# EAGLE design adapt (EAGLE 5.02)
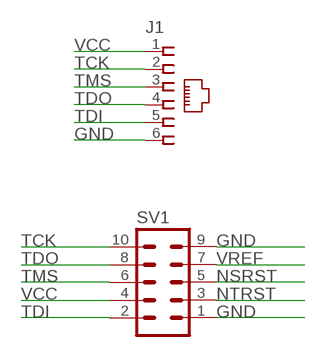
[diagram p0: schematic, sheet 1]

## Parts
J1  520250-3  [520250-3]
SV1  ML10L  [ML10L]

## Nets
GND: J1.6 SV1.1 SV1.9
NSRST: SV1.5
NTRST: SV1.3
TCK: J1.2 SV1.10
TDI: J1.5 SV1.2
TDO: J1.4 SV1.8
TMS: J1.3 SV1.6
VCC: J1.1 SV1.4
VREF: SV1.7

## Library data of the parts
J1 = con-amp:520250-3: AMP connector
SV1 = con-harting-ml:ML10: HARTING

## Board
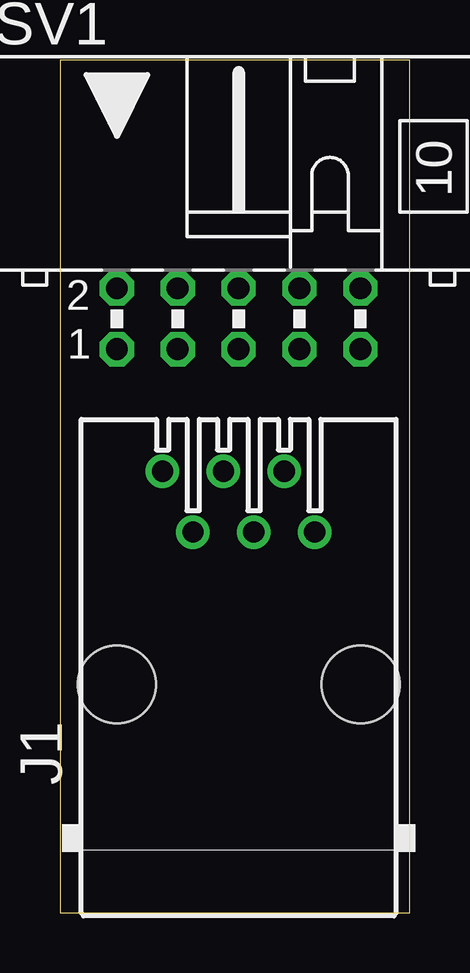
[diagram p1: board, top side]
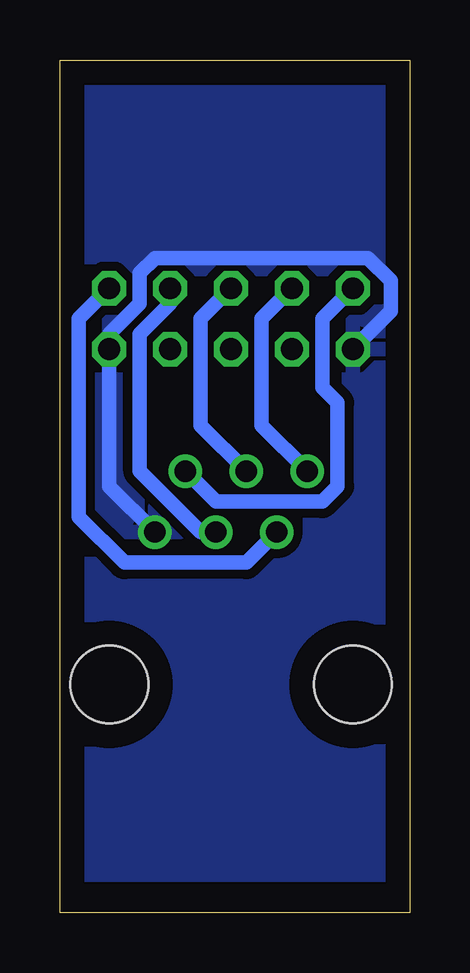
[diagram p2: board, bottom side, seen from below]

Size 14.59 x 35.55 mm. Coordinates in mm from the lower left corner, seen from the top.
Outline: 0,0 14.59,0 14.59,35.55 0,35.55 0,0
Copper layers (1*16): Top 0.035mm / dielectric 1.5mm / Bottom 0.035mm
Design rules "default *": minimum track width 10mil, minimum drill 24mil, track to track 15mil, track to pad 15mil, pad to pad 15mil, via to via 15mil, smd to smd 8mil, copper to edge 40mil, drill to drill 8mil, minimum pad ring 10mil, minimum via ring 8mil, stop-mask expansion 4mil, vias tented up to drill 0mil, thermal gap 10mil

### Footprints (pad centres in the part's own frame; a part is rotated, then mirrored left to right if it is on the bottom)
520250-3 = drill 0.889 round: 1 -3.175,8.89; 2 -1.905,6.35; 3 -0.635,8.89; 4 0.635,6.35; 5 1.905,8.89; 6 3.175,6.35 | hole 3.251: -5.08,0; 5.08,0
ML10L = drill 0.914 octagon: 1 -5.08,-1.27; 2 -5.08,1.27; 3 -2.54,-1.27; 4 -2.54,1.27; 5 0,-1.27; 6 0,1.27; 7 2.54,-1.27; 8 2.54,1.27; 9 5.08,-1.27; 10 5.08,1.27

### Placement (x,y rotation side)
J1  7.46,9.52 0 top
SV1  7.46,24.76 0 top

### Tracks (layer width: path | path; a pad name or v marks a point on that pad's centre or on a via)
GND
  Bottom 0.61: SV1.1 0.79,25.08 0.79,26.35 1.74,27.3 10.63,27.3 11.27,26.66 11.27,25.39 12.54,24.12 SV1.9 12.54,17.77 J1.6
  pour Bottom: 0.47,36.19 15.08,36.19 15.08,1.58 0.47,1.58
TCK
  Bottom 0.61: SV1.10 13.8,24.76 13.8,16.5 11.9,14.6 6.82,14.6 J1.2
TDI
  Bottom 0.61: SV1.2 3.65,24.76 3.65,21.9 3.01,21.27 3.01,17.77 3.65,17.14 8.09,17.14 J1.5
TDO
  Bottom 0.61: SV1.8 10,25.39 11.27,24.12 11.27,18.41 8.72,15.87 J1.4
TMS
  Bottom 0.61: SV1.6 8.72,24.76 8.72,20.31 J1.3
VCC
  Bottom 0.61: SV1.4 6.19,24.76 6.19,20.31 J1.1

### Text on the board
Dimension: UN TEXTE POUR LES ALIGNER TOUS | ET DANS LES TÉNÈBRES LES TIRER